# Altium project BLDC_F103C8Tx.PrjPcb
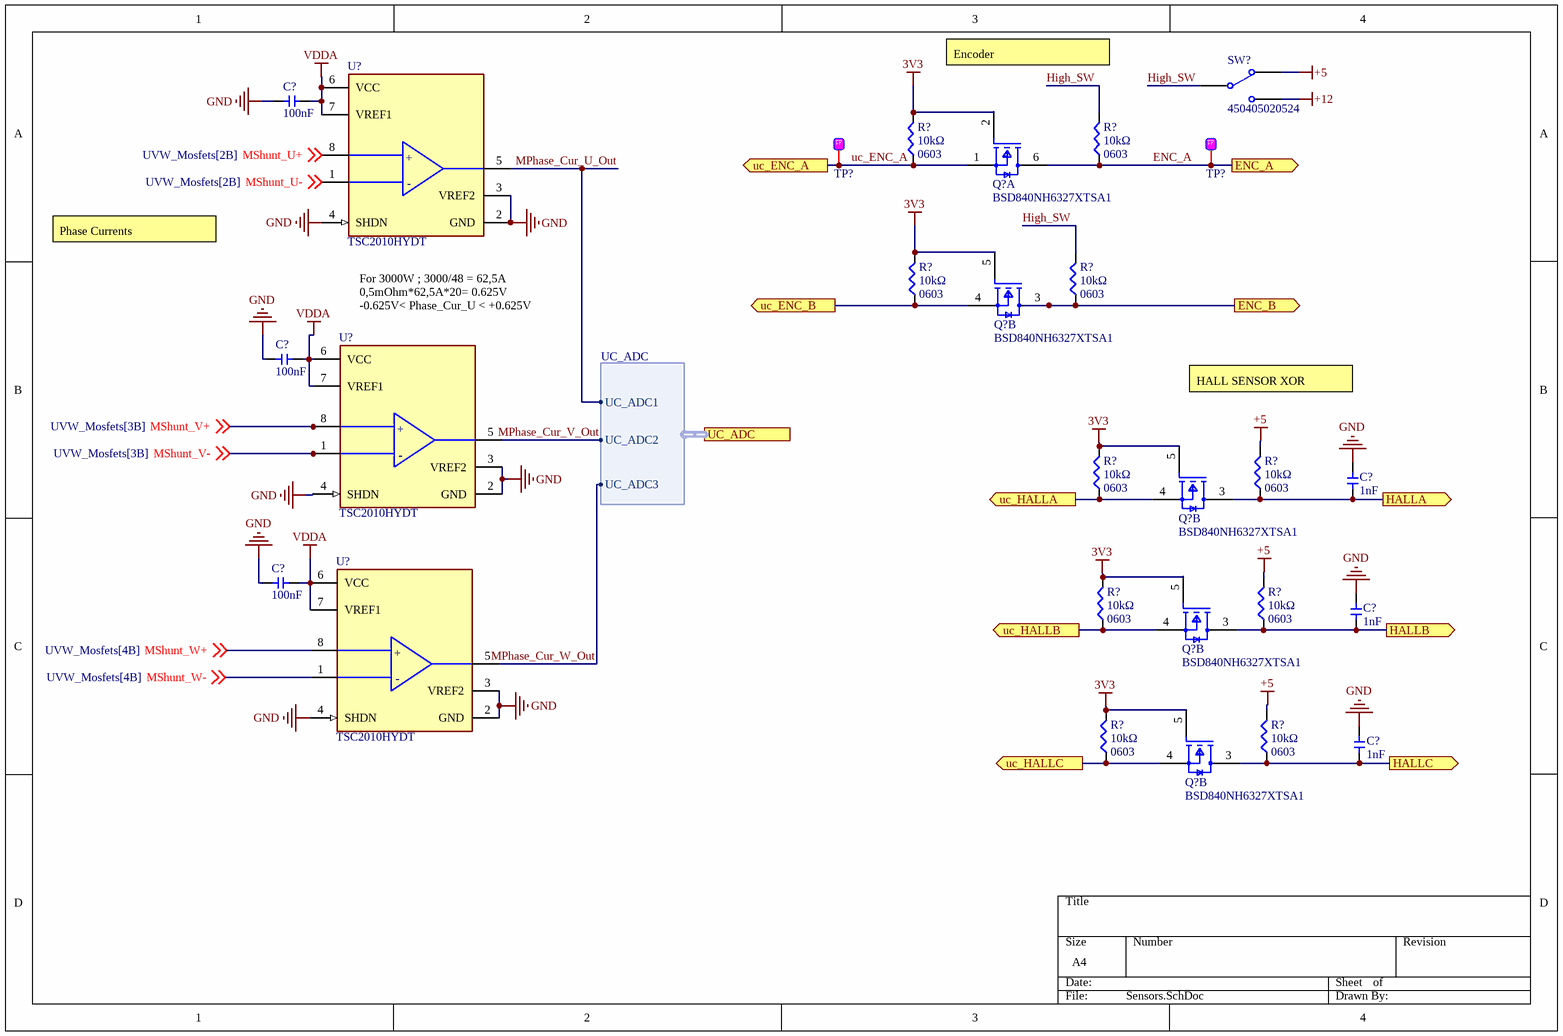
[diagram p0: Sensors.SchDoc]
6 sheets, 137 parts. Net scope: flat (ports and power ports of the same name join across sheets).
Sheets:
  Sensors.SchDoc
  UVW_Mosfets.SchDoc
  Debug.SchDoc
  comm.SchDoc
  POWER.SchDoc
  MOS_DRIVER.SchDoc

## Sheet Sensors.SchDoc
size A4; SheetNumber: 1; SheetTotal: 6

### Parts
(Parts that share a designator on the sheet are numbered #1, #2 ... from top to bottom, then left to right.)
C?#1  value 100nF  [0603_cap]  (hidden comment: 0603_100nF)
C?#2  value 100nF  [0603_cap]  (hidden comment: 0603_100nF)
C?#3  value 1nF  [0603_cap]  (hidden comment: 0603_1nF)
C?#4  value 100nF  [0603_cap]  (hidden comment: 0603_100nF)
C?#5  value 1nF  [0603_cap]  (hidden comment: 0603_1nF)
C?#6  value 1nF  [0603_cap]  (hidden comment: 0603_1nF)
Q?#1  BSD840NH6327XTSA1  [FP-PG-SOT363-6-IPC_A]  (part A of 2)
Q?#2  BSD840NH6327XTSA1  [FP-PG-SOT363-6-IPC_A]  (part B of 2)
Q?#3  BSD840NH6327XTSA1  [FP-PG-SOT363-6-IPC_A]  (part B of 2)
Q?#4  BSD840NH6327XTSA1  [FP-PG-SOT363-6-IPC_A]  (part B of 2)
Q?#5  BSD840NH6327XTSA1  [FP-PG-SOT363-6-IPC_A]  (part B of 2)
R?#1  value 10kΩ  Package: 0603  [0603-smd]  (hidden comment: 0603_10K)
R?#2  value 10kΩ  Package: 0603  [0603-smd]  (hidden comment: 0603_10K)
R?#3  value 10kΩ  Package: 0603  [0603-smd]  (hidden comment: 0603_10K)
R?#4  value 10kΩ  Package: 0603  [0603-smd]  (hidden comment: 0603_10K)
R?#5  value 10kΩ  Package: 0603  [0603-smd]  (hidden comment: 0603_10K)
R?#6  value 10kΩ  Package: 0603  [0603-smd]  (hidden comment: 0603_10K)
R?#7  value 10kΩ  Package: 0603  [0603-smd]  (hidden comment: 0603_10K)
R?#8  value 10kΩ  Package: 0603  [0603-smd]  (hidden comment: 0603_10K)
R?#9  value 10kΩ  Package: 0603  [0603-smd]  (hidden comment: 0603_10K)
R?#10  value 10kΩ  Package: 0603  [0603-smd]  (hidden comment: 0603_10K)
SW?  450405020524  [450405020524]
TP?#1  Test Point  [test_point]  (value not drawn)
TP?#2  Test Point  [test_point]  (value not drawn)
U?#1  TSC2010HYDT  [FP-SO8-IPC_A]
U?#2  TSC2010HYDT  [FP-SO8-IPC_A]
U?#3  TSC2010HYDT  [FP-SO8-IPC_A]

### Ports
ENC_A (out), ENC_B (out), HALLA (out), HALLB (out), HALLC (out), UC_ADC (harness UC_ADC), uc_ENC_A (out), uc_ENC_B (out), uc_HALLA (out), uc_HALLB (out), uc_HALLC (out)

### Harnesses
UC_ADC: UC_ADC1, UC_ADC2, UC_ADC3

### Nets
3V3: Q?#1.2(1_GATE) Q?#2.5(2_GATE) Q?#3.5(2_GATE) Q?#4.5(2_GATE) Q?#5.5(2_GATE) R?#1.2 R?#3.2 R?#5.2 R?#7.2 R?#9.2
+5: R?#6.2 R?#8.2 R?#10.2 SW?.L1
+12: SW?.L2
GND: C?#1.1 C?#2.1 C?#3.1 C?#4.1 C?#5.1 C?#6.1 U?#1.2(GND) U?#1.3(VREF2) U?#1.4(SHDN) U?#2.2(GND) U?#2.3(VREF2) U?#2.4(SHDN) U?#3.2(GND) U?#3.3(VREF2) U?#3.4(SHDN)
MShunt_U-: U?#1.1(IN-) ; off-sheet MShunt_U-  [project net U]
MShunt_V-: U?#2.1(IN-) ; off-sheet MShunt_V-  [project net V]
MShunt_W-: U?#3.1(IN-) ; off-sheet MShunt_W-  [project net W]
VDDA: C?#1.2 C?#2.2 C?#4.2 U?#1.6(VCC) U?#1.7(VREF1) U?#2.6(VCC) U?#2.7(VREF1) U?#3.6(VCC) U?#3.7(VREF1)
ENC_A: Q?#1.6(1_DRAIN) R?#2.1 TP?#2.1 ; port ENC_A
High_SW: R?#2.2 R?#4.2 SW?.COM
MPhase_Cur_U_Out: U?#1.5(OUT) ; port UC_ADC.UC_ADC1
MPhase_Cur_V_Out: U?#2.5(OUT) ; port UC_ADC.UC_ADC2
MPhase_Cur_W_Out: U?#3.5(OUT) ; port UC_ADC.UC_ADC3
MShunt_U+: U?#1.8(IN+) ; off-sheet MShunt_U+
MShunt_V+: U?#2.8(IN+) ; off-sheet MShunt_V+
MShunt_W+: U?#3.8(IN+) ; off-sheet MShunt_W+
uc_ENC_A: Q?#1.1(1_SOURCE) R?#1.1 TP?#1.1 ; port uc_ENC_A
NetC?#3_2: C?#3.2 Q?#3.3(2_DRAIN) R?#6.1 ; port HALLA
NetC?#5_2: C?#5.2 Q?#4.3(2_DRAIN) R?#8.1 ; port HALLB
NetC?#6_2: C?#6.2 Q?#5.3(2_DRAIN) R?#10.1 ; port HALLC
NetQ?#2_3: Q?#2.3(2_DRAIN) R?#4.1 ; port ENC_B
NetQ?#2_4: Q?#2.4(2_SOURCE) R?#3.1 ; port uc_ENC_B
NetQ?#3_4: Q?#3.4(2_SOURCE) R?#5.1 ; port uc_HALLA
NetQ?#4_4: Q?#4.4(2_SOURCE) R?#7.1 ; port uc_HALLB
NetQ?#5_4: Q?#5.4(2_SOURCE) R?#9.1 ; port uc_HALLC

### Notes on the sheet
- Encoder
- Phase Currents
- (near U?#2) For 3000W ; 3000/48 = 62,5A
  0,5mOhm*62,5A*20= 0.625V
  -0.625V< Phase_Cur_U < +0.625V
- HALL SENSOR XOR
- (in symbol CMP-12131-000017-1) +; -

### Library data of the parts
C?#1 C?#2 C?#4 = 0603_100nF: Volt: V; Package: 0603
C?#3 C?#5 C?#6 = 0603_1nF: Volt: V; Package: 0603
Q?#1-Q?#5 = CMP-32901-000170-1: MOSFET 2N-CH 20V 0.88A SOT363; Input Capacitance: 78pF; Rds On Max: 400mR; Max Power Dissipation: 500mW; Rise Time: 2.2ns; FET Type: 2 N-Channel; Continuous Drain Current (ID): 880mA; Gate to Source Voltage (Vgs): 8V; Halogen Free: Halogen Free; Case/Package: SOT-363-6; Mount: Surface Mount; Packaging: Tape and Reel; Lead Free: Lead Free; Max Operating Temperature: 150°C; Number of Pins: 6; Max Dual Supply Voltage: 20V; Drain to Source Voltage (Vdss): 20V; Min Operating Temperature: -55°C
R?#1-R?#10 = 0603_10K: Power: W
SW? = CMP-03913-107782335-1: 450405020524 WS-SLSU Mini Slide Switch; Insulation Resistance: 100MΩ; Min Operating Temperature: -40°C; RoHS: Compliant; Max Operating Temperature: 85°C; Packaging: Tape and Reel; NexarPartId: 107782335; Contact Plating: Silver
TP?#1 TP?#2 = TP
U?#1-U?#3 = CMP-12131-000017-1: IC CURRENT SENSE 1 CIRCUIT 8SOIC

## Sheet UVW_Mosfets.SchDoc
size A4; SheetNumber: 2; SheetTotal: 6
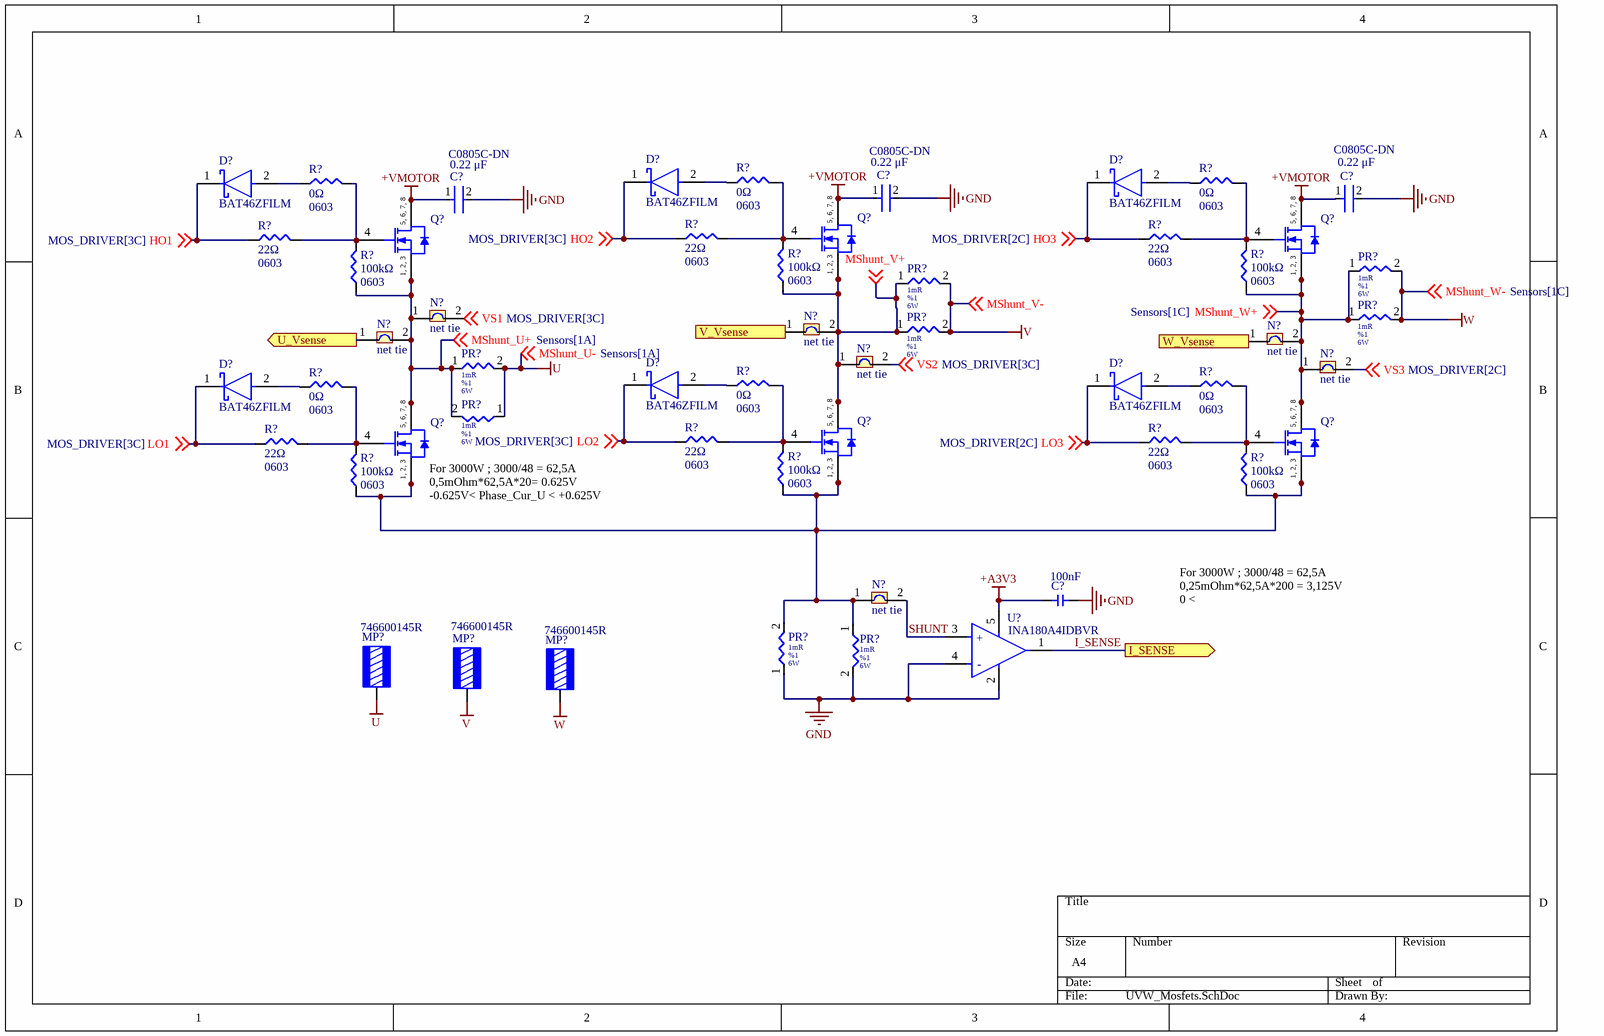
[diagram p1: UVW_Mosfets.SchDoc]

### Parts
(Parts that share a designator on the sheet are numbered #1, #2 ... from top to bottom, then left to right.)
C?#7  value 0.22 μF  Package: C0805C-DN  [FP-C0805C-DN-IPC_A]  (hidden comment: C0805C224K1RACTU)
C?#8  value 0.22 μF  Package: C0805C-DN  [FP-C0805C-DN-IPC_A]  (hidden comment: C0805C224K1RACTU)
C?#9  value 0.22 μF  Package: C0805C-DN  [FP-C0805C-DN-IPC_A]  (hidden comment: C0805C224K1RACTU)
C?#10  value 100nF  [0603_cap]  (hidden comment: 0603_100nF)
D?#1  BAT46ZFILM  [FP-SOD-123-MFG]
D?#2  BAT46ZFILM  [FP-SOD-123-MFG]
D?#3  BAT46ZFILM  [FP-SOD-123-MFG]
D?#4  BAT46ZFILM  [FP-SOD-123-MFG]
D?#5  BAT46ZFILM  [FP-SOD-123-MFG]
D?#6  BAT46ZFILM  [FP-SOD-123-MFG]
MP?#1  746600145R  [746600145]
MP?#2  746600145R  [746600145]
MP?#3  746600145R  [746600145]
N?#1  net tie  [net tie]  (net tie, no BOM)
N?#2  net tie  [net tie]  (net tie, no BOM)
N?#3  net tie  [net tie]  (net tie, no BOM)
N?#4  net tie  [net tie]  (net tie, no BOM)
N?#5  net tie  [net tie]  (net tie, no BOM)
N?#6  net tie  [net tie]  (net tie, no BOM)
N?#7  net tie  [net tie]  (net tie, no BOM)
PR?#1  value 1mR  Tolerance: %1  Power: 6W  [SMT-2512]  (hidden comment: EBWM2512F1L00S9)
PR?#2  value 1mR  Tolerance: %1  Power: 6W  [SMT-2512]  (hidden comment: EBWM2512F1L00S9)
PR?#3  value 1mR  Tolerance: %1  Power: 6W  [SMT-2512]  (hidden comment: EBWM2512F1L00S9)
PR?#4  value 1mR  Tolerance: %1  Power: 6W  [SMT-2512]  (hidden comment: EBWM2512F1L00S9)
PR?#5  value 1mR  Tolerance: %1  Power: 6W  [SMT-2512]  (hidden comment: EBWM2512F1L00S9)
PR?#6  value 1mR  Tolerance: %1  Power: 6W  [SMT-2512]  (hidden comment: EBWM2512F1L00S9)
PR?#7  value 1mR  Tolerance: %1  Power: 6W  [SMT-2512]  (hidden comment: EBWM2512F1L00S9)
PR?#8  value 1mR  Tolerance: %1  Power: 6W  [SMT-2512]  (hidden comment: EBWM2512F1L00S9)
Q?#6  TPH2R608NH,L1Q  [SOP Advance_TOS-L]  (value not drawn)
Q?#7  TPH2R608NH,L1Q  [SOP Advance_TOS-L]  (value not drawn)
Q?#8  TPH2R608NH,L1Q  [SOP Advance_TOS-L]  (value not drawn)
Q?#9  TPH2R608NH,L1Q  [SOP Advance_TOS-L]  (value not drawn)
Q?#10  TPH2R608NH,L1Q  [SOP Advance_TOS-L]  (value not drawn)
Q?#11  TPH2R608NH,L1Q  [SOP Advance_TOS-L]  (value not drawn)
R?#11  value 0Ω  Package: 0603  [0603-smd]  (hidden comment: 0603_0R)
R?#12  value 0Ω  Package: 0603  [0603-smd]  (hidden comment: 0603_0R)
R?#13  value 0Ω  Package: 0603  [0603-smd]  (hidden comment: 0603_0R)
R?#14  value 22Ω  Package: 0603  [0603-smd]  (hidden comment: 0603_22R)
R?#15  value 22Ω  Package: 0603  [0603-smd]  (hidden comment: 0603_22R)
R?#16  value 22Ω  Package: 0603  [0603-smd]  (hidden comment: 0603_22R)
R?#17  value 100kΩ  Package: 0603  [0603-smd]  (hidden comment: 0603_100K)
R?#18  value 100kΩ  Package: 0603  [0603-smd]  (hidden comment: 0603_100K)
R?#19  value 100kΩ  Package: 0603  [0603-smd]  (hidden comment: 0603_100K)
R?#20  value 0Ω  Package: 0603  [0603-smd]  (hidden comment: 0603_0R)
R?#21  value 0Ω  Package: 0603  [0603-smd]  (hidden comment: 0603_0R)
R?#22  value 0Ω  Package: 0603  [0603-smd]  (hidden comment: 0603_0R)
R?#23  value 22Ω  Package: 0603  [0603-smd]  (hidden comment: 0603_22R)
R?#24  value 22Ω  Package: 0603  [0603-smd]  (hidden comment: 0603_22R)
R?#25  value 22Ω  Package: 0603  [0603-smd]  (hidden comment: 0603_22R)
R?#26  value 100kΩ  Package: 0603  [0603-smd]  (hidden comment: 0603_100K)
R?#27  value 100kΩ  Package: 0603  [0603-smd]  (hidden comment: 0603_100K)
R?#28  value 100kΩ  Package: 0603  [0603-smd]  (hidden comment: 0603_100K)
U?#4  INA180A4IDBVR  [FP-DBV0005A-IPC_A]

### Ports
I_SENSE (out), U_Vsense (out), V_Vsense (out), W_Vsense (out)

### Nets
+A3V3: C?#10.1 U?#4.5(VS)
+VMOTOR: C?#7.1 C?#8.1 C?#9.1 Q?#6.5(DRAIN) Q?#6.6(DRAIN) Q?#6.7(DRAIN) Q?#6.8(DRAIN) Q?#7.5(DRAIN) Q?#7.6(DRAIN) Q?#7.7(DRAIN) Q?#7.8(DRAIN) Q?#8.5(DRAIN) Q?#8.6(DRAIN) Q?#8.7(DRAIN) Q?#8.8(DRAIN)
GND: C?#7.2 C?#8.2 C?#9.2 C?#10.2 PR?#7.2 PR?#8.1 U?#4.2(GND) U?#4.4(IN-)
U: MP?#1.1 PR?#5.2 PR?#6.1 ; off-sheet MShunt_U-  [also labelled MShunt_U-]
V: MP?#2.1 PR?#2.2 PR?#4.2 ; off-sheet MShunt_V-  [also labelled MShunt_V-]
W: MP?#3.1 PR?#1.2 PR?#3.2 ; off-sheet MShunt_W-  [also labelled MShunt_W-]
HO1: D?#1.1(C) R?#14.1 ; off-sheet HO1
HO2: D?#2.1(C) R?#15.1 ; off-sheet HO2
HO3: D?#3.1(C) R?#16.1 ; off-sheet HO3
I_SENSE: U?#4.1(OUT) ; port I_SENSE
LO1: D?#6.1(C) R?#23.1 ; off-sheet LO1
LO2: D?#4.1(C) R?#24.1 ; off-sheet LO2
LO3: D?#5.1(C) R?#25.1 ; off-sheet LO3
MShunt_U+: N?#1.1 N?#3.2 PR?#5.1 PR?#6.2 Q?#6.1(SOURCE) Q?#6.2(SOURCE) Q?#6.3(SOURCE) Q?#9.5(DRAIN) Q?#9.6(DRAIN) Q?#9.7(DRAIN) Q?#9.8(DRAIN) R?#17.1 ; off-sheet MShunt_U+
MShunt_V+: N?#2.2 N?#5.1 PR?#2.1 PR?#4.1 Q?#7.1(SOURCE) Q?#7.2(SOURCE) Q?#7.3(SOURCE) Q?#10.5(DRAIN) Q?#10.6(DRAIN) Q?#10.7(DRAIN) Q?#10.8(DRAIN) R?#18.1 ; off-sheet MShunt_V+
MShunt_W+: N?#4.2 N?#6.1 PR?#1.1 PR?#3.1 Q?#8.1(SOURCE) Q?#8.2(SOURCE) Q?#8.3(SOURCE) Q?#11.5(DRAIN) Q?#11.6(DRAIN) Q?#11.7(DRAIN) Q?#11.8(DRAIN) R?#19.1 ; off-sheet MShunt_W+
SHUNT: U?#4.3(IN+)
VS1: N?#1.2 ; off-sheet VS1
VS2: N?#5.2 ; off-sheet VS2
VS3: N?#6.2 ; off-sheet VS3
NetD?#1_2: D?#1.2(A) R?#11.1
NetD?#2_2: D?#2.2(A) R?#12.1
NetD?#3_2: D?#3.2(A) R?#13.1
NetD?#4_2: D?#4.2(A) R?#20.1
NetD?#5_2: D?#5.2(A) R?#21.1
NetD?#6_2: D?#6.2(A) R?#22.1
NetN?#2_1: N?#2.1 ; port V_Vsense
NetN?#3_1: N?#3.1 ; port U_Vsense
NetN?#4_1: N?#4.1 ; port W_Vsense
NetN?#7_1: N?#7.1 PR?#7.1 PR?#8.2 Q?#9.1(SOURCE) Q?#9.2(SOURCE) Q?#9.3(SOURCE) Q?#10.1(SOURCE) Q?#10.2(SOURCE) Q?#10.3(SOURCE) Q?#11.1(SOURCE) Q?#11.2(SOURCE) Q?#11.3(SOURCE) R?#26.1 R?#27.1 R?#28.1
NetQ?#6_4: Q?#6.4(GATE) R?#11.2 R?#14.2 R?#17.2
NetQ?#7_4: Q?#7.4(GATE) R?#12.2 R?#15.2 R?#18.2
NetQ?#8_4: Q?#8.4(GATE) R?#13.2 R?#16.2 R?#19.2
NetQ?#9_4: Q?#9.4(GATE) R?#22.2 R?#23.2 R?#26.2
NetQ?#10_4: Q?#10.4(GATE) R?#20.2 R?#24.2 R?#27.2
NetQ?#11_4: Q?#11.4(GATE) R?#21.2 R?#25.2 R?#28.2

Not connected (* = marked no-connect by the designer): N?#7 2

### Notes on the sheet
- (near Q?#9) For 3000W ; 3000/48 = 62,5A
  0,5mOhm*62,5A*20= 0.625V
  -0.625V< Phase_Cur_U < +0.625V
- For 3000W ; 3000/48 = 62,5A
  0,25mOhm*62,5A*200 = 3,125V
  0 < @{"Id":"UGEDVJUL\KTVDSUUQ"} < 3,125V
- (in symbol CMP-04895-000244-1) +; -
- (in symbol TPH2R608NH,L1Q) 5, 6, 7, 8; 1, 2, 3

### Library data of the parts
C?#7-C?#9 = CMP-2007-03262-2: CAP CER 0.22UF 100V 10% X7R 0805; Manufacturer: KEMET; Material: Ceramic; Tolerance: 0.1; Temperature Coefficient: 30ppm/°C; Temperature Range High: +125°C; Temperature Range Low: -55°C; Voltage Rating: 100 V; Device Class L2: Capacitors; Manufacturer Part Number: C0805C224K1RACTU; Octopart: https://octopart.com/c0805c224k1ractu-kemet-12818106; ComponentLink2URL: https://content.kemet.com/datasheets/KEM_C1003_C0G_SMD.pdf; RoHS: TRUE; Temperature: -55°C to +125°C; Ipc Land Pattern Name: CAPC200125X78; Category: Cap; ComponentLink2Description: Datasheet; Height: 0.88mm; Device Class L1: Passive Components; Digikey Description: CAP CER 0.22UF 100V 10% X7R 0805; Mouser Description: 0805 C 220nF Ceramic Multilayer Capacitor, 100 V, +125degC, X7R Dielec, +/-10%; Capacitance: 0.22 μF; Lead Free: Yes; Automotive: No; Temperature Characteristic: X7R; Device Class L3: Ceramic Capacitors
C?#10 = 0603_100nF: Volt: V; Package: 0603
D?#1-D?#6 = CMP-12187-000006-1: DIODE SCHOTTKY 100V 150MA SOD123; Manufacturer: STMicroelectronics; Max Surge Forward Current: 1A; Capacitance: 10pF; Standoff Height: 0mm; Peak Reverse Current: 5uA; Value: 10pF; Max Junction Temp: +150°C; Automotive: No; Ipc Land Pattern Name: SOD375155X145-2; Device Class L2: Diodes; Device Class L1: Discrete Semiconductors; Temperature Range High: +150°C; ComponentLink2Description: Datasheet; Lead Free: Yes; Digikey Description: DIODE SCHOTTKY 100V 150MA SOD123; RoHS: TRUE; Category: Diode; Max Repetitive Reverse Voltage: 100V; ComponentLink2URL: https://www.st.com/resource/en/datasheet/bat46.pdf; Manufacturer Part Number: BAT46ZFILM; Temperature: to +150°C; Mouser Description: Schottky Diodes & Rectifiers schottky diode; Package: SOD-123; Forward Current: 150mA; Octopart: https://octopart.com/bat46zfilm-stmicroelectronics-658190; Height: 1.45mm; Device Class L3: Schottky Diodes
MP?#1-MP?#3 = CMP-03913-99674487-1: 746600145R SMT REDCUBE Bush Reverse with Through Hole, 4.5 mm Ø Internal Hole, 86A, Vertical, WP-SMRT; Current Rating: 85A; RoHS: Compliant; Min Operating Temperature: -55°C; Max Operating Temperature: 150°C; Height: 3mm; Packaging: Tape and Reel; NexarPartId: 99674487; Material: Brass
PR?#1-PR?#8 = EBWM2512F1L00S9: Res 0.001 Ohm 1% 6W 2512; Manufacturer: Resion; Supplier 1: Digikey; Manufacturer Part Number: EBWM2512F1L00S9; RoHS: No; Category: Chip SMD Resistors; Stock 1: 17222; Pricing 1: 1=0,79, 10=0,449, 50=0,3226, 100=0,2829, 500=0,21686, 1000=0,19594 (USD); Supplier Part Number 1: 4506-EBWM2512F1L00S9CT-ND
Q?#6-Q?#11 = TPH2R608NH,L1Q: X35 Pb-F Power Mosfet Transistor Sop8-Adv Pd=142 W F=1Mhz; Mfr_Name: Toshiba Electronic Devices & Storage Corp.; Manufacturer: Toshiba; Continuous Drain Current (ID): 150A; Drain to Source Voltage (Vdss): 75V; Rds On Max: 2.6mR; Input Capacitance: 6nF; Max Power Dissipation: 142W; Type: Transistors; RefDes: RefDes; Supplier 1: Arrow Electronics; Manufacturer Part Number: TPH2R608NH,L1Q; RoHS: Yes; Category: MOSFETs; Stock 1: 59; Pricing 1: 1=1,2931, 10=1,0206, 25=0,5906 (USD); Mounting Technology: Surface Mount; Pins: 8; Packaging: Tape and Reel; ComponentLink1URL: http://www.mouser.com/ds/2/408/TPH2R608NH_datasheet_en_20150123-768911.pdf?src-supplier=Mouser; ComponentLink1Description: http://www.mouser.com/ds/2/408/TPH2R608NH_datasheet_en_20150123-768911.pdf?src-supplier=Mouser; ComponentLink2URL: https://toshiba.semicon-storage.com/info/docget.jsp?did=15733&prodName=TPH2R608NH&src-supplier=Digikey; ComponentLink2Description: https://toshiba.semicon-storage.com/info/docget.jsp?did=15733&prodName=TPH2R608NH&src-supplier=Digikey; Supplier Part Number 1: TPH2R608NH,L1Q
R?#11-R?#13 R?#20-R?#22 = 0603_0R: Power: W
R?#14-R?#16 R?#23-R?#25 = 0603_22R: Power: W
R?#17-R?#19 R?#26-R?#28 = 0603_100K: Power: W
U?#4 = CMP-04895-000244-1: IC CURR SENSE 1 CIRCUIT SOT23-5; Operating Supply Current: 260uA; Number of Circuits: 1; Input Bias Current: 100nA; -3db Bandwidth: 350kHz; Input Offset Voltage (Vos): 100uV; Slew Rate: 2V/µs; Case/Package: SOT-23-5; Min Operating Temperature: -40°C; Packaging: Tape and Reel; Max Operating Temperature: 125°C; Mount: Surface Mount; RoHS Compliant: Yes

## Sheet Debug.SchDoc
size A4; SheetNumber: 3; SheetTotal: 6
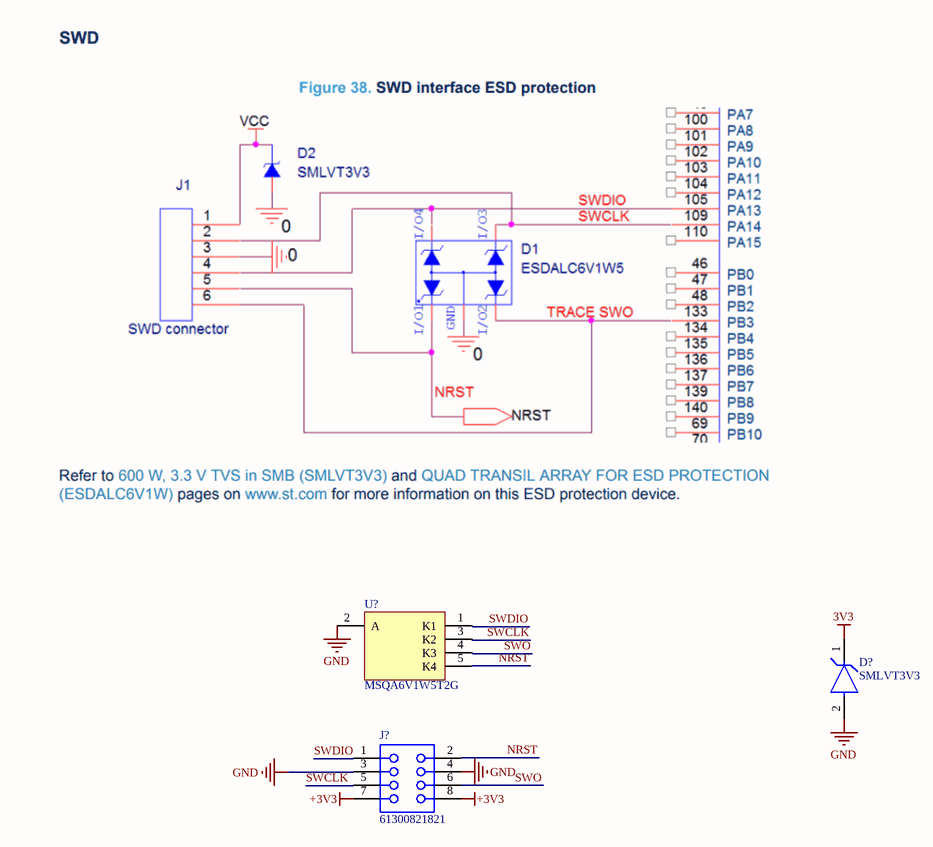
[diagram p2: Debug.SchDoc]

### Parts
(Parts that share a designator on the sheet are numbered #1, #2 ... from top to bottom, then left to right.)
D?#7  SMLVT3V3  [FP-SMB-MFG]
J?  61300821821  [61300821821]
U?#5  MSQA6V1W5T2G  [ONSC-SC70-5-419A-02_V]

### Nets
3V3: D?#7.1(K)
+3V3: J?.7 J?.8
GND: D?#7.2(A) J?.3 J?.4 U?#5.2(A)
NRST: J?.2 U?#5.5(K4)
SWCLK: J?.5 U?#5.3(K2)
SWDIO: J?.1 U?#5.1(K1)
SWO: J?.6 U?#5.4(K3)

### Library data of the parts
D?#7 = SMLVT3V3: TVS DIODE 3.3V 10.3V SMB; Manufacturer: STMicroelectronics; Standoff Height: 0.05mm; Max Junction Temp: +175°C; Capacitance: 5200pF; Breakdown Voltage: 4.1V; Peak Pulse Power: 600W; Clamping Voltage: 7.3V; Direction: Unidirectional; Number Of Channels: 1; Peak Pulse Current: 50A; Value: 5200pF; ComponentLink2Description: Datasheet; Digikey Description: TVS DIODE 3.3V 10.3V SMB; Automotive: No; Temperature Range Low: -55°C; Device Class L2: TVS Diodes; RoHS: TRUE; ComponentLink2URL: https://www.st.com/resource/en/datasheet/smlvt3v3.pdf; Temperature: -55°C to +175°C; Device Class L3: unset; Package: SMB; Lead Free: Yes; Mouser Description: TVS Diodes - Transient Voltage Suppressors 600W 3.3V Unidirect; Height: 2.65mm; Octopart: https://octopart.com/smlvt3v3-stmicroelectronics-347049; Temperature Range High: +175°C; Category: Diode; Manufacturer Part Number: SMLVT3V3; Device Class L1: Circuit Protection
J? = CMP-1502-01329-2: NexarPartId: 61924725; Current Rating: 3A; Gender: Female; Operating Supply Voltage: 250V; Contact Resistance: 20mΩ; Orientation: Vertical; Lead Pitch: 2.54mm; RoHS: Non-Compliant; Number of Pins: 8
U?#5 = CMP-1063-00034-1: Quad Array ESD Protection Diodes with Low Clamping Voltage, 5-Pin SC70, Pb-Free, Tape and Reel; Manufacturer: On Semiconductor; Number of Lines: 4; IR Max (uA): 1; V(BR) Min (V): 6.1; PPK Max (W): 150; C Max (pF): 90; Direction: Unidirectional; ComponentLink2URL: http://www.onsemi.cn/pub_link/Collateral/MSQA6V1W5T2-D.PDF; ComponentLink2Description: Datasheet; PackageDescription: 5-Pin Small Outline Transistor, Body 2 x 1.25 mm, Pitch 0.65 mm; PartNumber: MSQA6V1W5T2G; PackageReference: SC70-5-419A-02; Packing: Tape and Reel; Mounting Technology: Surface Mount; ComponentLink3Description: Package Specification; RoHS: Pb-Free; PackageVersion: Rev. L, 01/2013; ComponentLink3URL: http://www.onsemi.cn/pub_link/Collateral/419A-02.PDF; DatasheetVersion: Rev. 7; ComponentLink1Description: Manufacturer URL; ComponentLink1URL: http://www.onsemi.com/

## Sheet comm.SchDoc
size A4; SheetNumber: 4; SheetTotal: 6
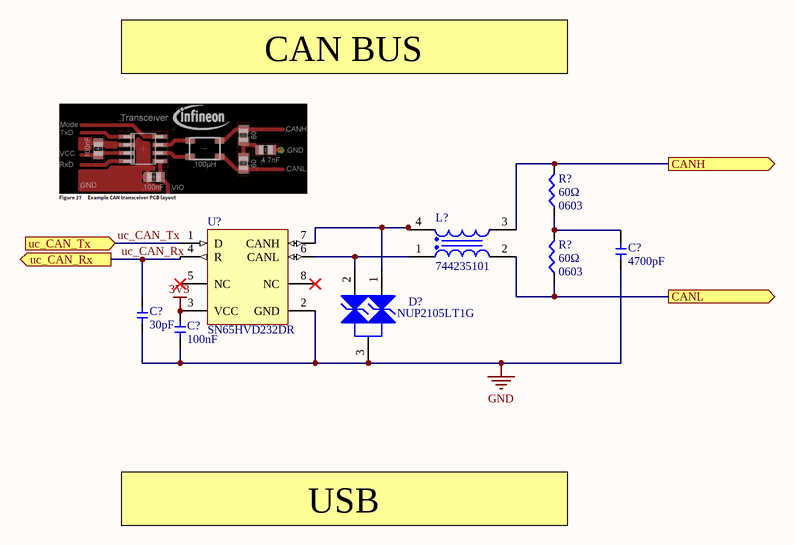
[diagram p3: comm.SchDoc]

### Parts
(Parts that share a designator on the sheet are numbered #1, #2 ... from top to bottom, then left to right.)
C?#11  value 4700pF  [0603_cap]  (hidden comment: 0603_4700pF)
C?#12  value 30pF  [0603_cap]  (hidden comment: 0603_30pF)
C?#13  value 100nF  [0603_cap]  (hidden comment: 0603_100nF)
D?#8  NUP2105LT1G  [ONSC-SOT-23-3-318-08_V]
L?#1  744235101  [WE-CNSW_1812]
R?#29  value 60Ω  Package: 0603  [0603-smd]  (hidden comment: 0603_60R)
R?#30  value 60Ω  Package: 0603  [0603-smd]  (hidden comment: 0603_60R)
U?#6  SN65HVD232DR  [D0008A_M]

### Ports
CANH (out), CANL (out), uc_CAN_Rx (out), uc_CAN_Tx (in)

### Nets
3V3: C?#13.2 U?#6.3(VCC)
GND: C?#11.1 C?#12.1 C?#13.1 D?#8.3(K) U?#6.2(GND)
uc_CAN_Rx: C?#12.2 U?#6.4(R) ; port uc_CAN_Rx
uc_CAN_Tx: U?#6.1(D) ; port uc_CAN_Tx
NetC?#11_2: C?#11.2 R?#29.1 R?#30.2
NetD?#8_1: D?#8.1(K) L?#1.4 U?#6.7(CANH)
NetD?#8_2: D?#8.2(K) L?#1.1 U?#6.6(CANL)
NetL?#1_2: L?#1.2 R?#30.1 ; port CANL
NetL?#1_3: L?#1.3 R?#29.2 ; port CANH

Not connected (* = marked no-connect by the designer): U?#6 5(NC)* 8(NC)*

### Notes on the sheet
- CAN BUS
- USB

### Library data of the parts
C?#11 = 0603_4700pF: Volt: V; Package: 0603
C?#12 = 0603_30pF: Volt: V; Package: 0603
C?#13 = 0603_100nF: Volt: V; Package: 0603
D?#8 = CMP-1063-00164-1: Dual Line CAN Bus Protector, 3-Pin SOT-23, Pb-Free, Tape and Reel; Manufacturer: On Semiconductor; IR Max (uA): 0.1; Number of Lines: 2; Direction: Bidirectional; C Max (pF): 30; PPK Max (W): 350; V(BR) Min (V): 26.2; ComponentLink3URL: http://www.onsemi.cn/pub_link/Collateral/318-08.PDF; Mounting Technology: Surface Mount; ComponentLink2Description: Datasheet; PartNumber: NUP2105LT1G; ComponentLink1URL: http://www.onsemi.com/; PackageVersion: Rev. AP, 11/2009; DatasheetVersion: Rev. 5; RoHS: Pb-Free; PackageReference: SOT-23-3-318-08; ComponentLink2URL: http://www.onsemi.cn/pub_link/Collateral/NUP2105L-D.PDF; ComponentLink1Description: Manufacturer URL; PackageDescription: 3-Pin Small Outline Transistor, Body 2.92 x 1.3 mm, Pitch 0.95 mm; Packing: Tape and Reel; ComponentLink3Description: Package Specification
L?#1 = CMP-207849-000010-2: CMC 100UH 150MA 2LN 8 KOHM SMD; NexarPartId: 61645269; Inductance: 100µH; Number of Lines: 2; DC Resistance (DCR): 2Ω; Voltage Rating (DC): 60V; Test Frequency: 100kHz; Max Current Rating: 150mA; RoHS: Compliant; Packaging: Tape & Reel (TR); Ambient Temperature Range Low: -40°C; Number of Pins: 4; Ambient Temperature Range High: 85°C; Min Operating Temperature: -40°C; Height: 2.8mm; RMS Current (Irms): 150mA; Width: 3.2mm; Current Rating: 150mA; Mount: Surface Mount; Max Operating Temperature: 125°C; Composition: Wirewound; Length: 4.5mm; Series Resistance: 2Ω; Voltage Rating: 60V
R?#29 R?#30 = 0603_60R: Power: W
U?#6 = CMP-0315-00075-2: 3.3 V Can Transceiver, 17 mA, -40 to 85 degC, 8-pin SOIC (D), Green (RoHS & no Sb/Br); Manufacturer: Texas Instruments; Supply Voltage(s)(V): 3.3; Receivers Per Package: 1; ICC(Max)(mA): 17; Rating: Catalog; Transient Pulse Protection(V): -25 to 25; Mounting Technology: Surface Mount; PartNumber: SN65HVD232DR; Code_JEDEC: MS-012AA; Eco-Plan: Green (RoHS & no Sb/Br); Isolated: No; SubFamily: CAN; Footprint: SN65HVD232; Drivers Per Package: 1; ComponentLink1URL: http://www.ti.com/general/docs/lit/getliterature.tsp?genericPartNumber=SN65HVD232&fileType=pdf; ComponentLink1Description: Datasheet; PackageDescription: 8-Pin Plastic Small Outline Integrated Circuit, 4.9 x 3.9 mm, Pitch 1.27 mm Pitch; PackageReference: D0008A; DatasheetVersion: SLOS346K; PackageVersion: revM, Jun-2011

## Sheet POWER.SchDoc
size A4; SheetNumber: 5; SheetTotal: 6
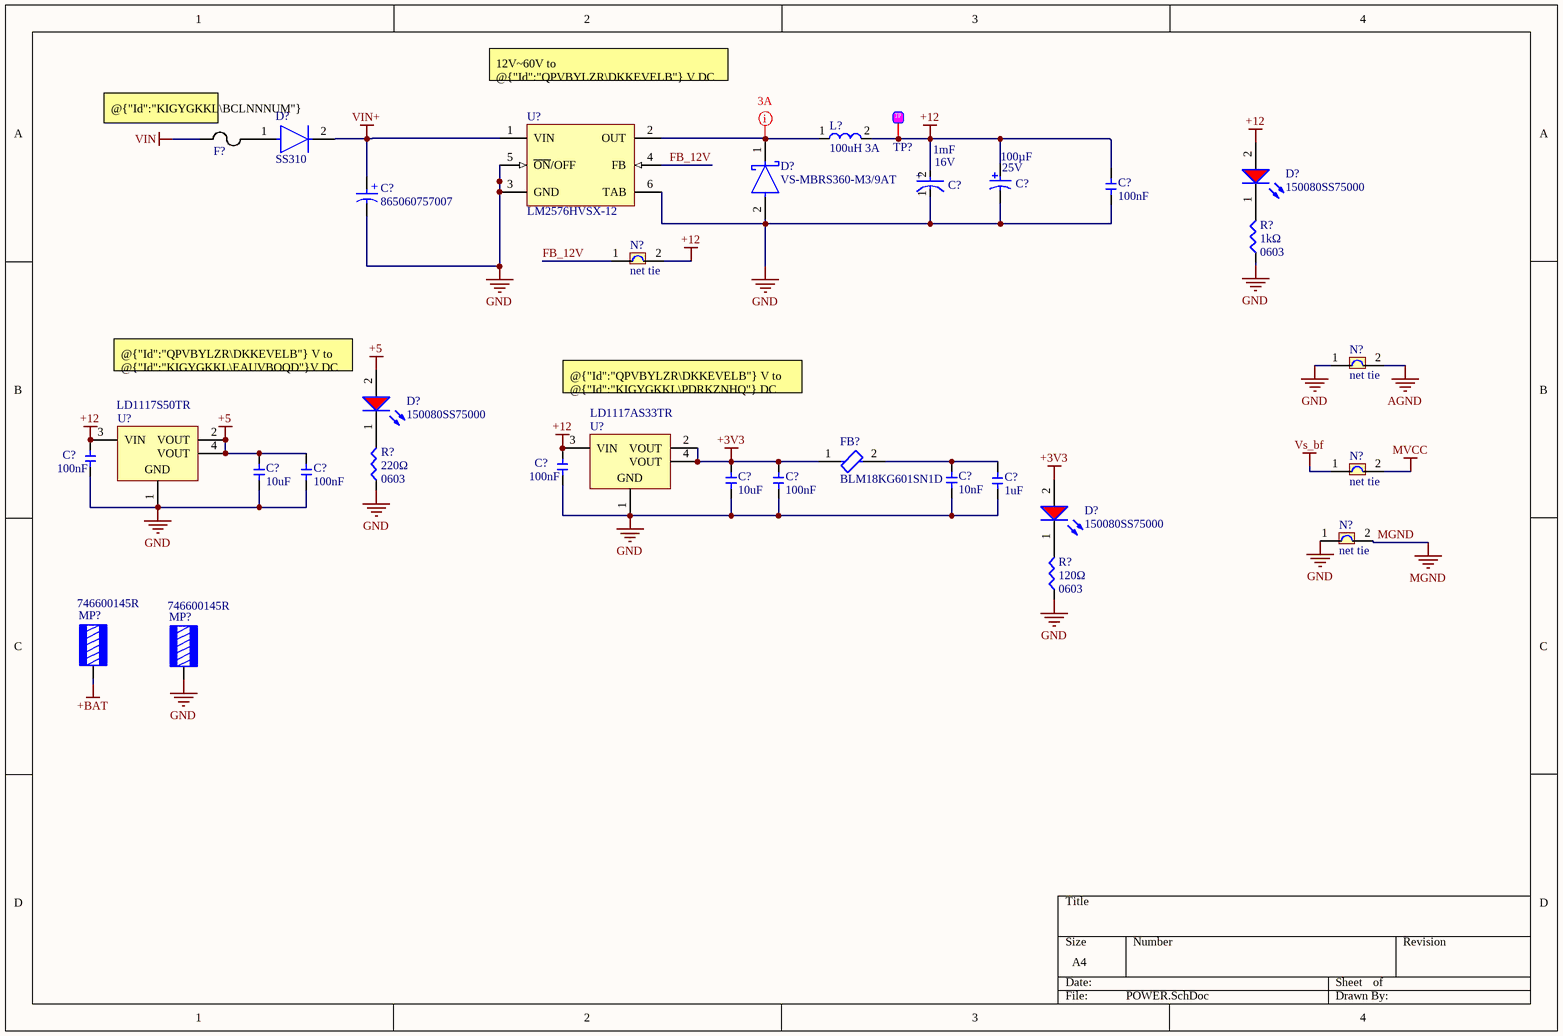
[diagram p4: POWER.SchDoc]

### Parts
(Parts that share a designator on the sheet are numbered #1, #2 ... from top to bottom, then left to right.)
C?#14  Capacitance: 100µF  Rated Voltage: 25V  [PNSC-FK-V-D8_V]  (hidden comment: EEEFK1E101XP)
C?#15  Voltage Rating (DC): 16V  Capacitance: 1mF  [FP-FTG-MFG]  (hidden comment: EEEFT1C102AP)
C?#16  865060757007  [WCAP-ASLL_D10H10.5]
C?#17  value 100nF  [0603_cap]  (hidden comment: 0603_100nF)
C?#18  value 100nF  [0603_cap]  (hidden comment: 0603_100nF)
C?#19  value 100nF  [0603_cap]  (hidden comment: 0603_100nF)
C?#20  value 10uF  [0603_cap]  (hidden comment: 0603_10uF)
C?#21  value 100nF  [0603_cap]  (hidden comment: 0603_100nF)
C?#22  value 10uF  [0603_cap]  (hidden comment: 0603_10uF)
C?#23  value 100nF  [0603_cap]  (hidden comment: 0603_100nF)
C?#24  value 10nF  [0603_cap]  (hidden comment: 0603_10nF)
C?#25  value 1uF  [0603_cap]  (hidden comment: 0603_1uF)
D?#9  SS310  [DO-214AC]
D?#10  150080SS75000  [WL-SMCW_0805_150080xx75000]
D?#11  VS-MBRS360-M3/9AT  [FP-95402-MFG]
D?#12  150080SS75000  [WL-SMCW_0805_150080xx75000]
D?#13  150080SS75000  [WL-SMCW_0805_150080xx75000]
F?  SBF32152ASTP  [1206_res]  (value not drawn)
FB?  BLM18KG601SN1D  [FP-BLM18-0_15-t0_8-IPC_A]
L?#2  100uH 3A  [MWSA1206S]
MP?#4  746600145R  [746600145]
MP?#5  746600145R  [746600145]
N?#8  net tie  [net tie]  (net tie, no BOM)
N?#9  net tie  [net tie]  (net tie, no BOM)
N?#10  net tie  [net tie]  (net tie, no BOM)
N?#11  net tie  [net tie]  (net tie, no BOM)
R?#31  value 1kΩ  Package: 0603  [0603-smd]  (hidden comment: 0603_1K)
R?#32  value 220Ω  Package: 0603  [0603-smd]  (hidden comment: 0603_220R)
R?#33  value 120Ω  Package: 0603  [0603-smd]  (hidden comment: 0603_120R)
TP?#3  Test Point  [test_point]  (value not drawn)
U?#7  LM2576HVSX-12  [KTT0005B_L]
U?#8  LD1117S50TR  [SOT-223_L]
U?#9  LD1117AS33TR  [SOT-223_L]

### Nets
+3V3: C?#22.2 C?#23.2 D?#13.2(A) FB?.1 U?#9.2(VOUT) U?#9.4(VOUT)
+5: C?#20.2 C?#21.2 D?#12.2(A) U?#8.2(VOUT) U?#8.4(VOUT)
+12: C?#14.1 C?#15.2(A) C?#17.2 C?#18.2 C?#19.2 D?#10.2(A) L?#2.2 N?#8.2 TP?#3.1 U?#8.3(VIN) U?#9.3(VIN)
+BAT: MP?#4.1
AGND: N?#9.2
GND: C?#14.2 C?#15.1(C) C?#16.2(N) C?#17.1 C?#18.1 C?#19.1 C?#20.1 C?#21.1 C?#22.1 C?#23.1 C?#24.1 C?#25.1 D?#11.2(A) MP?#5.1 N?#9.1 N?#11.1 R?#31.1 R?#32.1 R?#33.1 U?#7.3(GND) U?#7.5(~{ON}/OFF) U?#7.6(TAB) U?#8.1(GND) U?#9.1(GND)
MGND: N?#11.2
MVCC: N?#10.2
VIN: F?.1
VIN+: C?#16.1(P) D?#9.2 U?#7.1(VIN)
Vs_bf: N?#10.1
FB_12V: N?#8.1 U?#7.4(FB)
NetC?#24_2: C?#24.2 C?#25.2 FB?.2
NetD?#9_1: D?#9.1 F?.2
NetD?#10_1: D?#10.1(K) R?#31.2
NetD?#11_1: D?#11.1(C) L?#2.1 U?#7.2(OUT)
NetD?#12_1: D?#12.1(K) R?#32.2
NetD?#13_1: D?#13.1(K) R?#33.2

### Layout directives
mark named 3A: NetD?#11_1

### Notes on the sheet
- 12V~60V to @{"Id":"QPVBYLZR\DKKEVELB"} V DC CONVERTER
- (near F?) @{"Id":"KIGYGKKL\BCLNNNUM"} is till 60V
- (near D?#12) @{"Id":"QPVBYLZR\DKKEVELB"} V to @{"Id":"KIGYGKKL\EAUVBOQD"}V DC CONVERTER
- @{"Id":"QPVBYLZR\DKKEVELB"} V to @{"Id":"KIGYGKKL\PDRKZNHQ"} DC CONVERTER
- (in symbol CMP-03913-89507486-1) +
- (in symbol CMP-05427-000086-1) +

### Library data of the parts
C?#14 = CMP-2000-06206-1: Aluminum Electrolytic Capacitor, 100 uF, +/- 20%, 25 V, 2-Pin SMD (Size Code D8), -55 to 105 degC, RoHS, Tape and Reel; Manufacturer: Panasonic; Type: Can; Lifetime@Temperature: 2000Hrs@105°C; Ripple Current: 280mA; Impedance: 0.34O; Case Size/Dimension: Ø6.3x7.7mm; Operating Temp-Max: 105°C; Series: FK; Package URL: http://industrial.panasonic.com/cdbs/www-data/pdf/RDE0000/DME0000COL48.pdf; Mounting Technology: SurfaceMount; Package Description: 2-Pin Electrolytic Aluminum Capacitor, Body 6.6 x 6.6 mm; Datasheet Version: 03/2016; Datasheet URL: http://industrial.panasonic.com/cdbs/www-data/pdf/RDE0000/ABA0000C1181.pdf; Manufacturer URL: http://www.panasonic.com/; Package Reference: FK-V-D8; Operating Temp Range: -55to+105°C
C?#15 = CMP-05427-000086-1: CAP ALUM 1000UF 20% 16V SMD; Life (Hours): 2000Hour; Ripple Current: 1.19A; ESR (Equivalent Series Resistance): 60mR; Leakage Current: 160uA; Lead Diameter: 0.9mm; Height: 10.2mm; Radiation Hardening: No; Tolerance: 20%; Lead Free: Lead Free; Construction: Cylindrical; Package Quantity: 1; REACH SVHC: No SVHC; Series: FT; Packaging: Tape and Reel; RoHS Compliant: Yes; Lead Pitch: 4.6mm; Diameter: 10mm; Voltage Rating: 16V; Height - Seated (Max): 0.413inch; Length: 10.2mm; Voltage: 16V; Max Operating Temperature: 105°C; Ripple Current (AC): 1.19A; Min Operating Temperature: -55°C; Termination: SMD/SMT; Mount: Surface Mount; Case/Package: Radial
C?#16 = CMP-03913-89507486-1: 865060757007 WCAP-ASLL Aluminum Electrolytic Capacitors; Leakage Current: 63µA; Voltage Rating: 63V; Ripple Current: 420mA; Insulation Resistance: 1MΩ; Impedance: 240mΩ; Capacitance: 100µF; NexarPartId: 89507486; Diameter: 10mm; RoHS: Non-Compliant; Width: 10.3mm; Height: 10.5mm; Voltage Rating (DC): 63V; Length: 10.5mm; Packaging: Cut Tape
C?#17-C?#19 C?#21 C?#23 = 0603_100nF: Volt: V; Package: 0603
C?#20 C?#22 = 0603_10uF: Volt: V; Package: 0603
C?#24 = 0603_10nF: Volt: V; Package: 0603
C?#25 = 0603_1uF: Volt: V; Package: 0603
D?#10 D?#12 D?#13 = CMP-1426-00010-3: NexarPartId: 29717782; Peak Wavelength: 645nm; Luminous Intensity: 60mcd; Max Junction Temperature (Tj): 95°C; Wavelength: 630nm; Forward Current: 100mA; Max Reverse Voltage (DC): 5V; Color: Red; Lens Style: Clear, Rectangular; Test Current: 20mA; Power Dissipation: 72mW; Viewing Angle: 140°; Forward Voltage: 1.9V; Case Code (Metric): 2012; Max Operating Temperature: 85°C; Mount: Surface Mount; Height: 700µm; Case/Package: 0805; Min Operating Temperature: -40°C; Reverse Voltage: 5V; RoHS: Compliant; Packaging: Tape and Reel; REACH SVHC: Unknown; Case Code (Imperial): 0805; Length: 2mm; Width: 1.25mm; Dominant Wavelength: 630nm
D?#11 = CMP-02539-000065-1: DIODE SCHOTTKY 60V 3A DO214AB; Peak Non-Repetitive Surge Current: 790A; Forward Voltage: 740mV; Max Reverse Current: 500uA; Element Configuration: Single; Min Operating Temperature: -55°C; Packaging: Tape and Reel; Average Rectified Current: 3A; Max Operating Temperature: 150°C; Number of Pins: 2; Mount: Surface Mount; Contact Plating: Tin; Case/Package: DO-214AB; Max Forward Surge Current (Ifsm): 790A; Max Reverse Voltage (DC): 60V; Reach SVHC Compliant: Yes; RoHS Compliant: Yes; Forward Current: 3A; Max Repetitive Reverse Voltage (Vrrm): 60V; Series: -; Lead Free: Lead Free
F? = SBF32152ASTP: Fuse Chip 1.5A 63VDC 1206; Manufacturer: Kamaya; Supplier 1: Mouser; Manufacturer Part Number: SBF32152ASTP; Supplier Part Number 1: 791-SBF32152ASTP
FB? = CMP-0686-00581-3: Chip Ferrite Bead, 0603, 600Ω @ 100MHz, 0.15Ω, 25%, 1.3A; Material: Steel; Number of Lines: 1; Impedance: 600R; DC Resistance (DCR): 150mR; Tolerance: 25%; Case Code (Metric): 1608; Width: 0.8mm; DC Current: 1.3A; Max DC Current: 1.3A; Package Quantity: 1; Number of Pins: 2; Military Standard: Not; RoHS Compliant: Yes; Termination: SMD/SMT; Max Operating Temperature: 125°C; Length: 1.6mm; Depth: 0.8mm; Case Code (Imperial): 0603; Series: BLM18K; Inductor Type: FERRITE BEAD; Core Material: Ferrite; Number of Circuits: 1; Height: 0.8mm; Case/Package: 0603; REACH SVHC: No SVHC; Packaging: Tape and Reel; Min Operating Temperature: -55°C; Max Current Rating: 1.3A; Radiation Hardening: No; Current Rating: 1.3A; Lead Free: Lead Free; Test Frequency: 100MHz; Weight: 7.1E-05oz
L?#2 = MWSA1206S: Supplier 1: Digi-Key; ComponentLink1Description: datasheet; ComponentLink1URL: https://mm.digikey.com/Volume0/opasdata/d220001/medias/docus/2905/MWSA-S_Series_DS.pdf; Supplier Part Number 1: 3442-MWSA1206S-101MTCT-ND
MP?#4 MP?#5 = CMP-03913-99674487-1: as MP?#1 on sheet UVW_Mosfets; RoHS: Compliant; Min Operating Temperature: -55°C; Max Operating Temperature: 150°C; Height: 3mm; Packaging: Tape and Reel; NexarPartId: 99674487; Material: Brass
R?#31 = 0603_1K: Power: W
R?#32 = 0603_220R: Power: W
R?#33 = 0603_120R: Power: W
TP?#3 = TP
U?#7 = CMP-0069-00140-3: SIMPLE SWITCHER® 3A Step-Down Voltage Regulator, 5-pin TO-263; Manufacturer: Texas Instruments; PowerWise: N; PackageTopMarking: NSUZXYTTE#*LM2576*HVS-12 P+; PackageReference: KTT0005B; CompType: Switcher; RoHS: N; ComponentLink1URL: http://www.ti.com/general/docs/lit/getliterature.tsp?genericPartNumber=LM2576HV&fileType=pdf; Code_JEDEC: MO-169-AB; ComponentLink1Description: Datasheet URL; PackageDescription: TO-263, Molded, .400 x .390 x .180in, 5 Lead, .067in Pitch, Surface Mount; PinCount: 5
U?#8 = CMP-0244-00312-1: Fixed Low Drop Positive Voltage Regulator, 5V, 4-Pin SOT-223, Tape and Reel; ComponentLink1URL: http://www.st.com; DatasheetVersion: 1/11/2011; PackageDescription: 4-Pin SOT-223 Package, 6.5 x 3.5 mm Body, 2.3 mm Pitch, 7 mm Lead Span; ComponentLink2URL: http://www.st.com/internet/com/TECHNICAL_RESOURCES/TECHNICAL_LITERATURE/DATASHEET/CD00000544.pdf; ComponentLink1Description: Manufacturer URL; PackageReference: SOT-223; PackageVersion: 2010; ComponentLink2Description: Datasheet
U?#9 = CMP-0244-00316-1: 1A, Low Drop Positive Voltage Regulator, 3.3V, 4-Pin SOT-223, Tape and Reel; ComponentLink1Description: Manufacturer URL; DatasheetVersion: 2/12/2011; PackageVersion: 2010; ComponentLink1URL: http://www.st.com; ComponentLink2Description: Datasheet; ComponentLink2URL: http://www.st.com/internet/com/TECHNICAL_RESOURCES/TECHNICAL_LITERATURE/DATASHEET/CD00002116.pdf; PackageDescription: 4-Pin SOT-223 Package, 6.5 x 3.5 mm Body, 2.3 mm Pitch, 7 mm Lead Span; PackageReference: SOT-223
D?#9 = SS310: Supplier 1: Digi-Key; Supplier Part Number 1: 1801-SS310CT-ND

## Sheet MOS_DRIVER.SchDoc
size A4; SheetNumber: 6; SheetTotal: 6
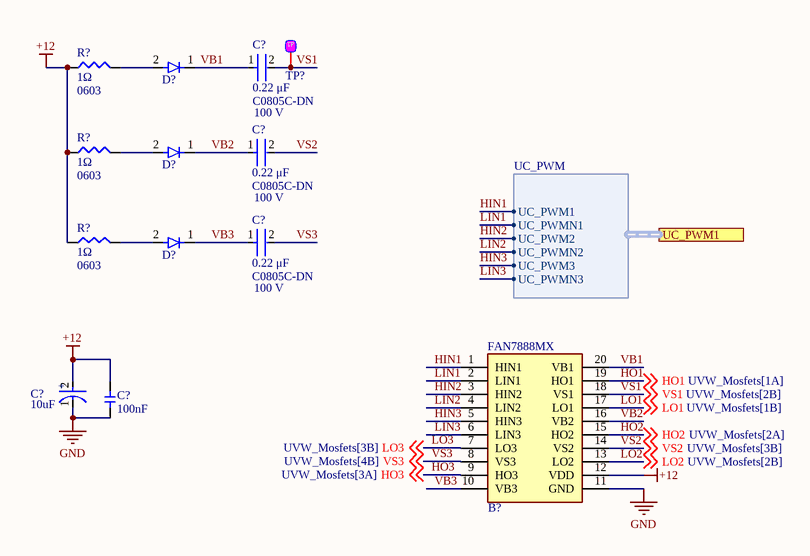
[diagram p5: MOS_DRIVER.SchDoc]

### Parts
(Parts that share a designator on the sheet are numbered #1, #2 ... from top to bottom, then left to right.)
B?  FAN7888MX  [SOIC127P1032X265-20N]
C?#26  value 0.22 μF  Voltage Rating: 100 V  Package: C0805C-DN  [FP-C0805C-DN-IPC_A]  (hidden comment: C0805C224K1RACTU)
C?#27  value 0.22 μF  Voltage Rating: 100 V  Package: C0805C-DN  [FP-C0805C-DN-IPC_A]  (hidden comment: C0805C224K1RACTU)
C?#28  value 0.22 μF  Voltage Rating: 100 V  Package: C0805C-DN  [FP-C0805C-DN-IPC_A]  (hidden comment: C0805C224K1RACTU)
C?#29  Capacitance: 10uF  [FP-SC-MFG]  (hidden comment: EEE1VA100SR)
C?#30  value 100nF  [0603_cap]  (hidden comment: 0603_100nF)
D?#14  DSS110U  [SODFL3618X110N]  (value not drawn)
D?#15  DSS110U  [SODFL3618X110N]  (value not drawn)
D?#16  DSS110U  [SODFL3618X110N]  (value not drawn)
R?#34  value 1Ω  Package: 0603  [0603-smd]  (hidden comment: 0603_1R)
R?#35  value 1Ω  Package: 0603  [0603-smd]  (hidden comment: 0603_1R)
R?#36  value 1Ω  Package: 0603  [0603-smd]  (hidden comment: 0603_1R)
TP?#4  Test Point  [test_point]  (value not drawn)

### Ports
UC_PWM1 (harness UC_PWM)

### Harnesses
UC_PWM: UC_PWM1, UC_PWM2, UC_PWM3, UC_PWMN1, UC_PWMN2, UC_PWMN3

### Nets
+12: B?.12(VDD) C?#29.2(A) C?#30.2 R?#34.1 R?#35.1 R?#36.1
GND: B?.11(GND) C?#29.1(C) C?#30.1
HIN1: B?.1(HIN1) ; port UC_PWM1.UC_PWM1
HIN2: B?.3(HIN2) ; port UC_PWM1.UC_PWM2
HIN3: B?.5(HIN3) ; port UC_PWM1.UC_PWM3
HO1: B?.19(HO1) ; off-sheet HO1
HO2: B?.15(HO2) ; off-sheet HO2
HO3: B?.9(HO3) ; off-sheet HO3
LIN1: B?.2(LIN1) ; port UC_PWM1.UC_PWMN1
LIN2: B?.4(LIN2) ; port UC_PWM1.UC_PWMN2
LIN3: B?.6(LIN3) ; port UC_PWM1.UC_PWMN3
LO1: B?.17(LO1) ; off-sheet LO1
LO2: B?.13(LO2) ; off-sheet LO2
LO3: B?.7(LO3) ; off-sheet LO3
VB1: B?.20(VB1) C?#26.1 D?#14.1
VB2: B?.16(VB2) C?#27.1 D?#15.1
VB3: B?.10(VB3) C?#28.1 D?#16.1
VS1: B?.18(VS1) C?#26.2 TP?#4.1 ; off-sheet VS1
VS2: B?.14(VS2) C?#27.2 ; off-sheet VS2
VS3: B?.8(VS3) C?#28.2 ; off-sheet VS3
NetD?#14_2: D?#14.2 R?#34.2
NetD?#15_2: D?#15.2 R?#35.2
NetD?#16_2: D?#16.2 R?#36.2

### Notes on the sheet
- (in symbol CMP-05427-000087-1) +

### Library data of the parts
B? = FAN7888MX: IC, Fairchild, FAN7888MX Fairchild Semiconductor FAN7888MX, Triple MOSFET Power Driver 350 mA, 650 mA Half Bridge, 10  20 V, Inverting; Manufacturer_Name: onsemi; Geometry.Height: 2.65mm; Manufacturer_Part_Number: FAN7888MX; Mouser Part Number: 512-FAN7888MX; Mouser Price/Stock: https://www.mouser.com/Search/Refine.aspx?Keyword=512-FAN7888MX; Arrow Part Number: FAN7888MX; Arrow Price/Stock: https://www.arrow.com/en/products/fan7888mx/on-semiconductor?region=nac; Datasheet Link: https://datasheet.datasheetarchive.com/originals/distributors/Datasheets_SAMA/c3972c1f85deead54c211aade99f8627.pdf; Supplier 1: Arrow Electronics; Supplier Part Number 1: FAN7888MX
C?#26-C?#28 = CMP-2007-03262-2: as C?#7 on sheet UVW_Mosfets; Temperature Range High: +125°C; Temperature Range Low: -55°C; Device Class L2: Capacitors; Manufacturer Part Number: C0805C224K1RACTU; Octopart: https://octopart.com/c0805c224k1ractu-kemet-12818106; ComponentLink2URL: https://content.kemet.com/datasheets/KEM_C1003_C0G_SMD.pdf; RoHS: TRUE; Temperature: -55°C to +125°C; Ipc Land Pattern Name: CAPC200125X78; Category: Cap; ComponentLink2Description: Datasheet; Height: 0.88mm; Device Class L1: Passive Components; Digikey Description: CAP CER 0.22UF 100V 10% X7R 0805; Mouser Description: 0805 C 220nF Ceramic Multilayer Capacitor, 100 V, +125degC, X7R Dielec, +/-10%; Capacitance: 0.22 μF; Lead Free: Yes; Automotive: No; Temperature Characteristic: X7R; Device Class L3: Ceramic Capacitors
C?#29 = CMP-05427-000087-1: CAP ALUM 10UF 20% 35V SMD; Life (Hours): 2000Hour; Lead Length: 2.2mm; Ripple Current (AC): 30mA; Leakage Current: 3uA; Length: 5.5mm; Construction: Cylindrical; Diameter: 5mm; RoHS Compliant: Yes; REACH SVHC: No SVHC; Max Operating Temperature: 85°C; Series: S; Case/Package: Radial; Contact Plating: Tin; Packaging: Tape and Reel; Voltage Rating: 35V; Number of Pins: 2; Height: 5.4mm; Width: 5.3mm; Voltage Rating (DC): 35V; Mount: Surface Mount; Tolerance: 20%; Lead Pitch: 1.5mm; Radiation Hardening: No; Height - Seated (Max): 0.213inch; Ripple Current: 30mA; Voltage: 35V; Package Quantity: 1; Termination: SMD/SMT; Min Operating Temperature: -40°C
C?#30 = 0603_100nF: Volt: V; Package: 0603
D?#14-D?#16 = SOD-123FL: Diode 100 V 1A Surface Mount SOD-123FL; ComponentLink1Description: New link; ComponentLink1URL: *; Supplier 1: Future Electronics; Supplier Part Number 1: 6125592
R?#34-R?#36 = 0603_1R: Power: W
TP?#4 = TP

## Nets that join several sheets
3V3: Sensors (10 pins), Debug (D?#7.1), comm (C?#13.2 U?#6.3)
+3V3: Debug (J?.7 J?.8), POWER (6 pins)
+5: Sensors (R?#6.2 R?#8.2 R?#10.2 SW?.L1), POWER (5 pins)
+12: Sensors (SW?.L2), POWER (11 pins), MOS_DRIVER (6 pins)
GND: Sensors (15 pins), UVW_Mosfets (8 pins), Debug (D?#7.2 J?.3 J?.4 U?#5.2), comm (5 pins), POWER (24 pins), MOS_DRIVER (B?.11 C?#29.1 C?#30.1)
U: Sensors (U?#1.1), UVW_Mosfets (MP?#1.1 PR?#5.2 PR?#6.1)
V: Sensors (U?#2.1), UVW_Mosfets (MP?#2.1 PR?#2.2 PR?#4.2)
W: Sensors (U?#3.1), UVW_Mosfets (MP?#3.1 PR?#1.2 PR?#3.2)
HO1: UVW_Mosfets (D?#1.1 R?#14.1), MOS_DRIVER (B?.19)
HO2: UVW_Mosfets (D?#2.1 R?#15.1), MOS_DRIVER (B?.15)
HO3: UVW_Mosfets (D?#3.1 R?#16.1), MOS_DRIVER (B?.9)
LO1: UVW_Mosfets (D?#6.1 R?#23.1), MOS_DRIVER (B?.17)
LO2: UVW_Mosfets (D?#4.1 R?#24.1), MOS_DRIVER (B?.13)
LO3: UVW_Mosfets (D?#5.1 R?#25.1), MOS_DRIVER (B?.7)
MShunt_U+: Sensors (U?#1.8), UVW_Mosfets (12 pins)
MShunt_V+: Sensors (U?#2.8), UVW_Mosfets (12 pins)
MShunt_W+: Sensors (U?#3.8), UVW_Mosfets (12 pins)
VS1: UVW_Mosfets (N?#1.2), MOS_DRIVER (B?.18 C?#26.2 TP?#4.1)
VS2: UVW_Mosfets (N?#5.2), MOS_DRIVER (B?.14 C?#27.2)
VS3: UVW_Mosfets (N?#6.2), MOS_DRIVER (B?.8 C?#28.2)